# Altium project MB.PrjPcb (part 1 of 3)
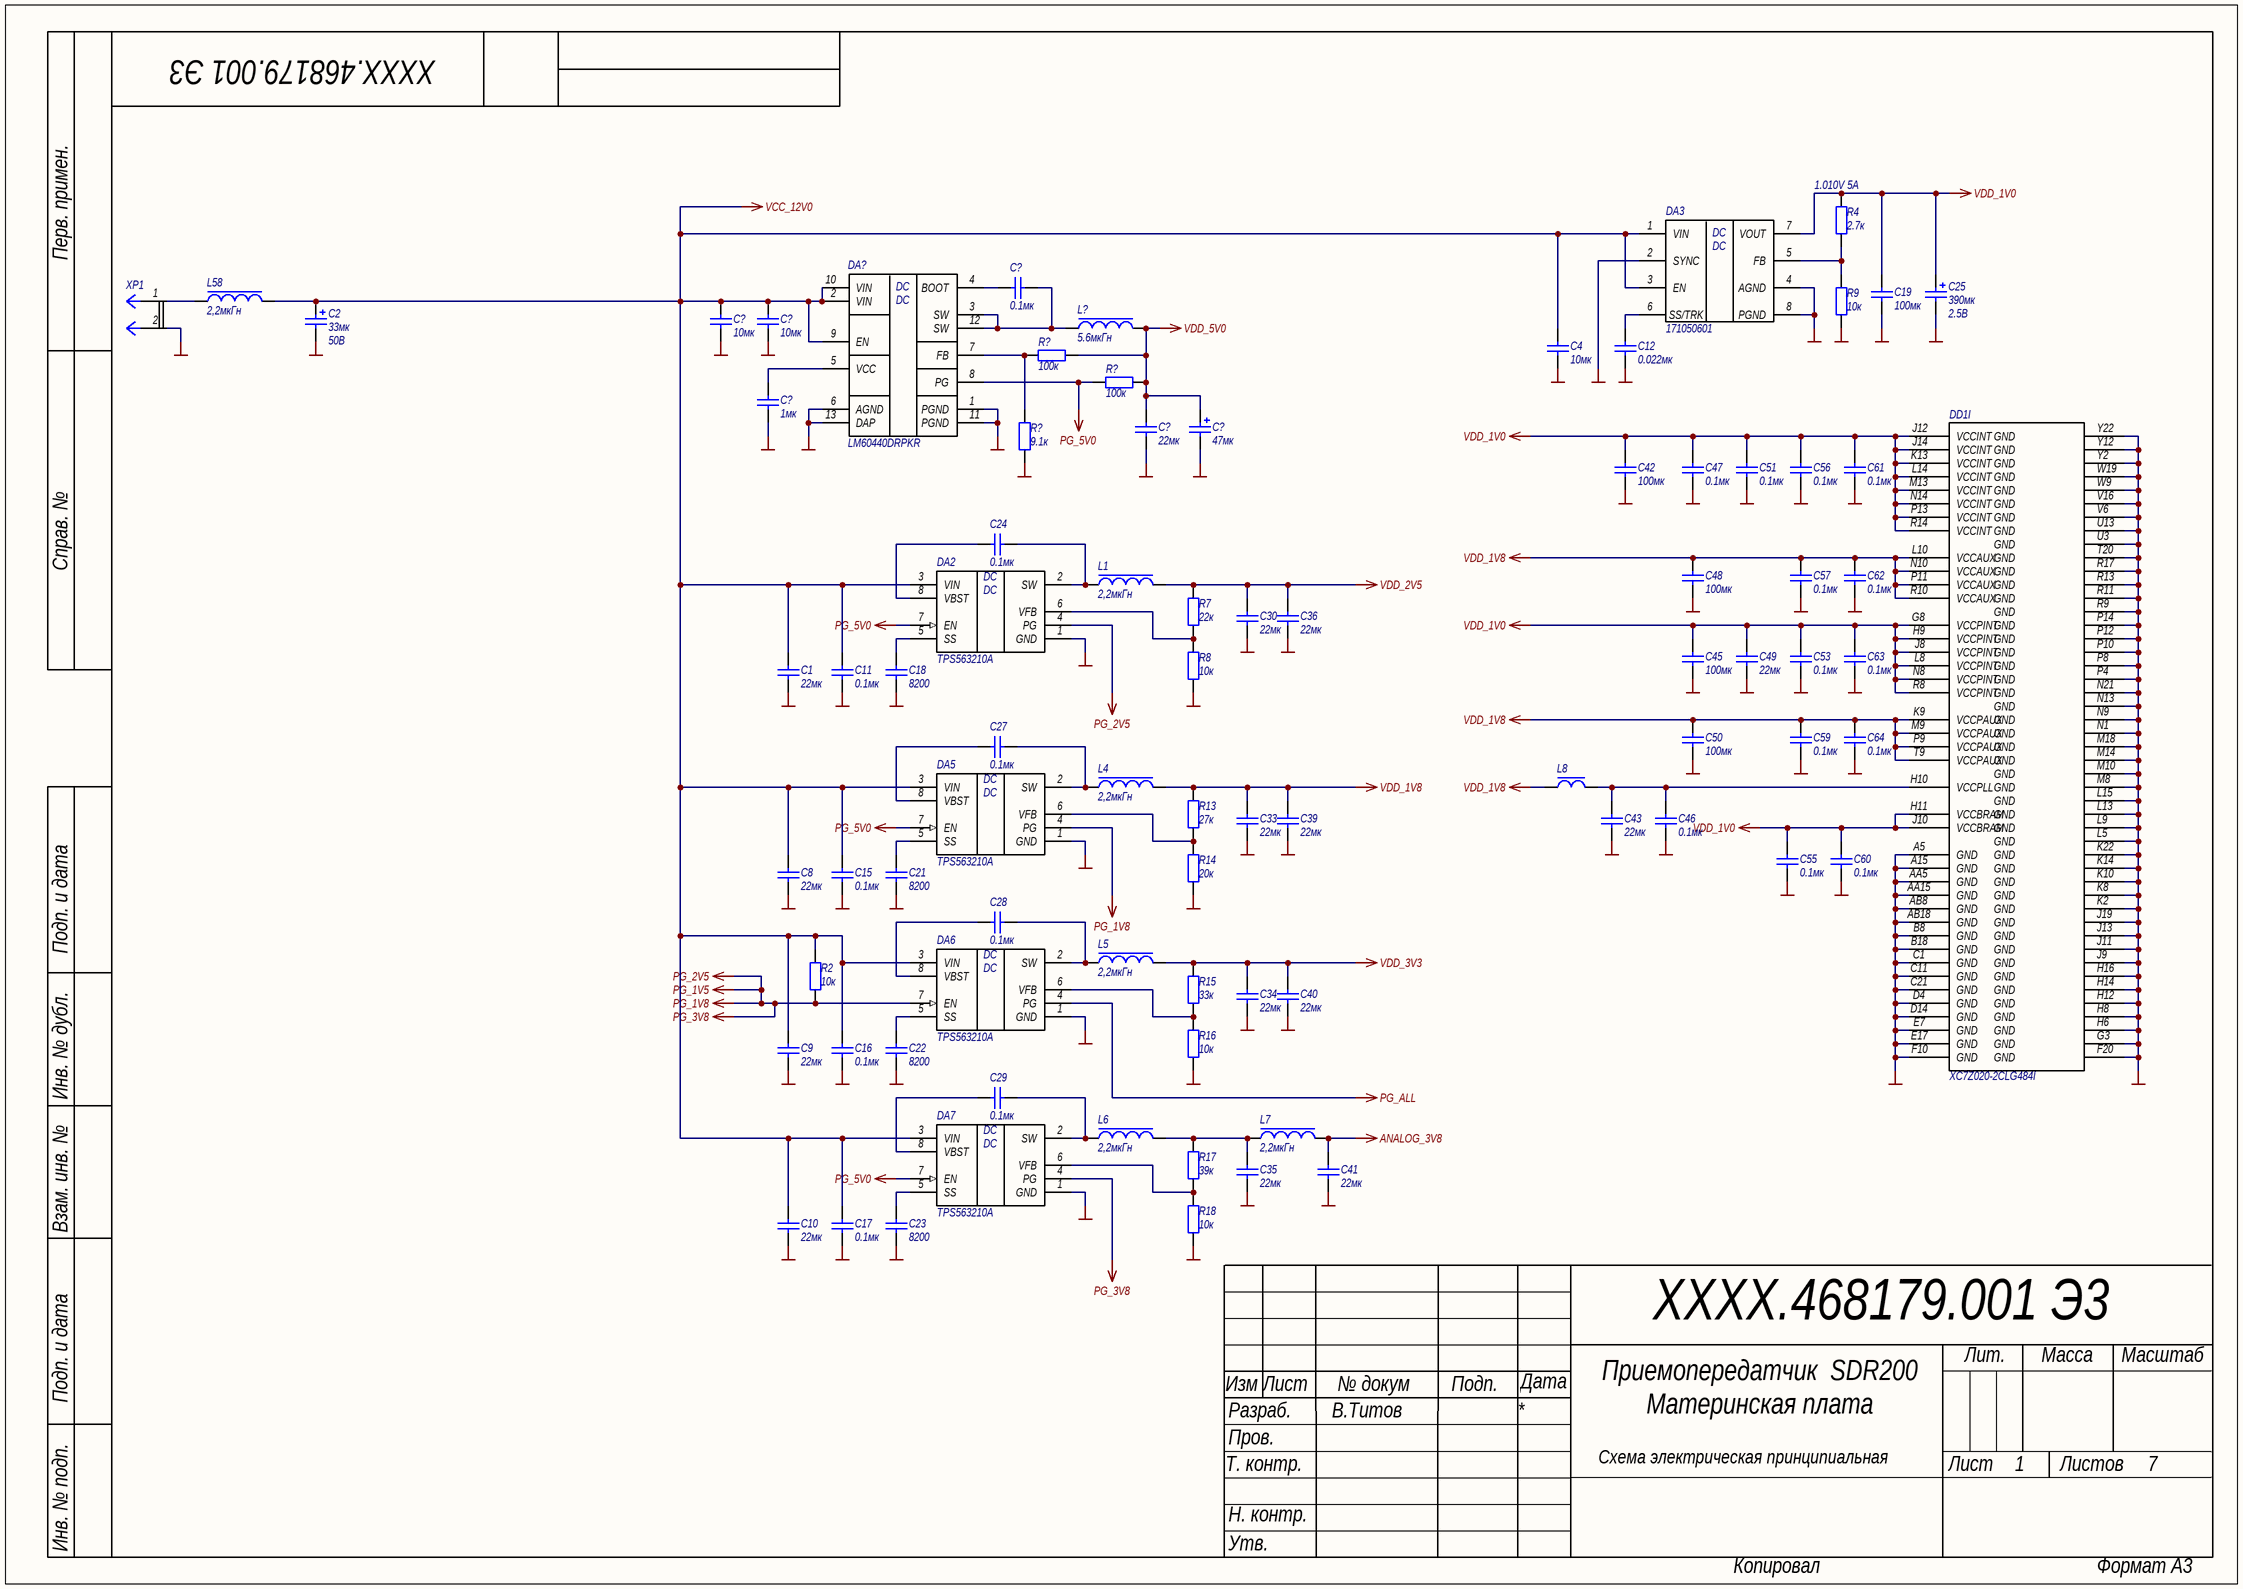
[diagram p0: MB_pwr_in_v2.SchDoc]
7 sheets, 655 parts. Net scope: global (net labels, ports and power ports of the same name join across sheets).
Board file: MB_v1.PcbDoc
Sheets:
  MB_pwr_in_v2.SchDoc
  MB_ps_io.SchDoc
  MB_ddr.SchDoc
  MB_pl_io.SchDoc
  MB_adc_clk.SchDoc
  MB_dac.SchDoc
  MB_audio.SchDoc

## Sheet MB_pwr_in_v2.SchDoc: Приемопередатчик  SDR200
size 420 x 297 mm; Author: В.Титов; DrawnBy: В.Титов; DocumentNumber: ХХХХ.468179.001 Э3; SheetNumber: 1; SheetTotal: 7; DocumentType: Схема электрическая принципиальная; Title2: Материнская плата; Scale: 1:1

### Parts
(Parts that share a designator on the sheet are numbered #1, #2 ... from top to bottom, then left to right.)
C1  22мк  [CAPC2012X12L]
C2  Power/Voltage: 50В  [CAPAE7664X77L]  (hidden comment: 33мк)
C4  10мк  [CAPC3225X27L]
C8  22мк  [CAPC2012X12L]
C9  22мк  [CAPC2012X12L]
C10  22мк  [CAPC2012X12L]
C11  0.1мк  [CAPC1005X06N]
C12  0.022мк  [CAPC1005X06N]
C15  0.1мк  [CAPC1005X06N]
C16  0.1мк  [CAPC1005X06N]
C17  0.1мк  [CAPC1005X06N]
C18  8200  [CAPC1005X06N]
C19  100мк  [CAPC3216X19L]
C21  8200  [CAPC1005X06N]
C22  8200  [CAPC1005X06N]
C23  8200  [CAPC1005X06N]
C24  0.1мк  [CAPC1005X06N]
C25  Power/Voltage: 2.5В  [CAPAE7266X61N]  (hidden comment: 390мк)
C27  0.1мк  [CAPC1005X06N]
C28  0.1мк  [CAPC1005X06N]
C29  0.1мк  [CAPC1005X06N]
C30  22мк  [CAPC2012X12L]
C33  22мк  [CAPC2012X12L]
C34  22мк  [CAPC2012X12L]
C35  22мк  [CAPC2012X12L]
C36  22мк  [CAPC2012X12L]
C39  22мк  [CAPC2012X12L]
C40  22мк  [CAPC2012X12L]
C41  22мк  [CAPC2012X12L]
C42  100мк  [CAPC3216X19L]
C43  22мк  [CAPC2012X12L]
C45  100мк  [CAPC3216X19L]
C46  0.1мк  [CAPC1005X06N]
C47  0.1мк  [CAPC1005X06N]
C48  100мк  [CAPC3216X19L]
C49  22мк  [CAPC2012X12L]
C50  100мк  [CAPC3216X19L]
C51  0.1мк  [CAPC1005X06N]
C53  0.1мк  [CAPC1005X06N]
C55  0.1мк  [CAPC1005X06N]
C56  0.1мк  [CAPC1005X06N]
C57  0.1мк  [CAPC1005X06N]
C59  0.1мк  [CAPC1005X06N]
C60  0.1мк  [CAPC1005X06N]
C61  0.1мк  [CAPC1005X06N]
C62  0.1мк  [CAPC1005X06N]
C63  0.1мк  [CAPC1005X06N]
C64  0.1мк  [CAPC1005X06N]
C?#1  0.1мк  [CAPC1005X06N]
C?#2  10мк  [CAPC3225X27L]
C?#3  10мк  [CAPC3225X27L]
C?#4  1мк  [CAPC1005X06N]
C?#5  22мк  [CAPC2012X12L]
C?#6  47мк  [CAPMP7343X28L]
DA2  TPS563210A  [TSOP65P280X110-8N]
DA3  171050601  [TO263-7EP]
DA5  TPS563210A  [TSOP65P280X110-8N]
DA6  TPS563210A  [TSOP65P280X110-8N]
DA7  TPS563210A  [TSOP65P280X110-8N]
DA?  LM60440DRPKR  [WQFN-13]
DD1  XC7Z020-2CLG484I  [BGA484C80P22X22_1900X1900X160]  (part I of 9)
L1  2,2мкГн  [CSAB0420]
L4  2,2мкГн  [CSAB0420]
L5  2,2мкГн  [CSAB0420]
L6  2,2мкГн  [CSAB0420]
L7  2,2мкГн  [CSAB0420]
L8  BLM18PG121SN1D  [INDC1608X08L]  (value not drawn)
L58  2,2мкГн  [CSAB0420]
L?  5.6мкГн  [Coilcraft-XAL5030]
R2  10к  [RESC1005X06N]
R4  2.7к  [RESC1005X06N]
R7  22к  [RESC1005X06N]
R8  10к  [RESC1005X06N]
R9  10к  [RESC1005X06N]
R13  27к  [RESC1005X06N]
R14  20к  [RESC1005X06N]
R15  33к  [RESC1005X06N]
R16  10к  [RESC1005X06N]
R17  39к  [RESC1005X06N]
R18  10к  [RESC1005X06N]
R?#1  100к  [RESC1005X06N]
R?#2  100к  [RESC1005X06N]
R?#3  9.1к  [RESC1005X06N]
XP1  XT30UPB-M  [XT30UPB-M]  (value not drawn)

### Nets
ANALOG_3V8: C41.2 L7.2
GND: C1.1 C2.2 C4.1 C8.1 C9.1 C10.1 C11.1 C12.1 C15.1 C16.1 C17.1 C18.1 C19.1 C21.1 C22.1 C23.1 C25.2 C30.1 C33.1 C34.1 C35.1 C36.1 C39.1 C40.1 C41.1 C42.1 C43.1 C45.1 C46.1 C47.1 C48.1 C49.1 C50.1 C51.1 C53.1 C55.1 C56.1 C57.1 C59.1 C60.1 C61.1 C62.1 C63.1 C64.1 C?#2.1 C?#3.1 C?#4.1 C?#5.1 C?#6.2 DA2.1(GND) DA3.2(SYNC) DA3.4(AGND) DA3.8(PGND) DA5.1(GND) DA6.1(GND) DA7.1(GND) DA?.1(PGND) DA?.6(AGND) DA?.11(PGND) DA?.13(DAP) DD1.A5(GND) DD1.A15(GND) DD1.AA5(GND) DD1.AA15(GND) DD1.AB8(GND) DD1.AB18(GND) DD1.B8(GND) DD1.B18(GND) DD1.C1(GND) DD1.C11(GND) DD1.C21(GND) DD1.D4(GND) DD1.D14(GND) DD1.E7(GND) DD1.E17(GND) DD1.F10(GND) DD1.F20(GND) DD1.G3(GND) DD1.H6(GND) DD1.H8(GND) DD1.H12(GND) DD1.H14(GND) DD1.H16(GND) DD1.J9(GND) DD1.J11(GND) DD1.J13(GND) DD1.J19(GND) DD1.K2(GND) DD1.K8(GND) DD1.K10(GND) DD1.K14(GND) DD1.K22(GND) DD1.L5(GND) DD1.L9(GND) DD1.L13(GND) DD1.L15(GND) DD1.M8(GND) DD1.M10(GND) DD1.M14(GND) DD1.M18(GND) DD1.N1(GND) DD1.N9(GND) DD1.N13(GND) DD1.N21(GND) DD1.P4(GND) DD1.P8(GND) DD1.P10(GND) DD1.P12(GND) DD1.P14(GND) DD1.R9(GND) DD1.R11(GND) DD1.R13(GND) DD1.R17(GND) DD1.T20(GND) DD1.U3(GND) DD1.U13(GND) DD1.V6(GND) DD1.V16(GND) DD1.W9(GND) DD1.W19(GND) DD1.Y2(GND) DD1.Y12(GND) DD1.Y22(GND) R8.2 R9.2 R14.2 R16.2 R18.2 R?#3.2 XP1.2
PG_1V5: DA2.4(PG) DA5.4(PG) DA6.7(EN) DA7.4(PG) R2.1  [also labelled PG_1V8, PG_2V5, PG_3V8]
PG_5V0: DA2.7(EN) DA5.7(EN) DA7.7(EN) DA?.8(PG) R?#2.2
PG_ALL: DA6.4(PG)
VCC_12V0: C1.2 C2.1 C4.2 C8.2 C9.2 C10.2 C11.2 C15.2 C16.2 C17.2 C?#2.2 C?#3.2 DA2.3(VIN) DA3.1(VIN) DA3.3(EN) DA5.3(VIN) DA6.3(VIN) DA7.3(VIN) DA?.2(VIN) DA?.9(EN) DA?.10(VIN) L58.2 R2.2
VDD_1V0: C19.2 C25.1 C42.2 C45.2 C47.2 C49.2 C51.2 C53.2 C55.2 C56.2 C60.2 C61.2 C63.2 DA3.7(VOUT) DD1.G8(VCCPINT) DD1.H9(VCCPINT) DD1.H11(VCCBRAM) DD1.J8(VCCPINT) DD1.J10(VCCBRAM) DD1.J12(VCCINT) DD1.J14(VCCINT) DD1.K13(VCCINT) DD1.L8(VCCPINT) DD1.L14(VCCINT) DD1.M13(VCCINT) DD1.N8(VCCPINT) DD1.N14(VCCINT) DD1.P13(VCCINT) DD1.R8(VCCPINT) DD1.R14(VCCINT) R4.2
VDD_1V8: C33.2 C39.2 C48.2 C50.2 C57.2 C59.2 C62.2 C64.2 DD1.K9(VCCPAUX) DD1.L10(VCCAUX) DD1.M9(VCCPAUX) DD1.N10(VCCAUX) DD1.P9(VCCPAUX) DD1.P11(VCCAUX) DD1.R10(VCCAUX) DD1.T9(VCCPAUX) L4.2 L8.1 R13.2
VDD_2V5: C30.2 C36.2 L1.2 R7.2
VDD_3V3: C34.2 C40.2 L5.2 R15.2
VDD_5V0: C?#5.2 C?#6.1 L?.2 R?#1.1 R?#2.1
NetC12_2: C12.2 DA3.6(SS/TRK)
NetC18_2: C18.2 DA2.5(SS)
NetC21_2: C21.2 DA5.5(SS)
NetC22_2: C22.2 DA6.5(SS)
NetC23_2: C23.2 DA7.5(SS)
NetC24_1: C24.1 DA2.2(SW) L1.1
NetC24_2: C24.2 DA2.8(VBST)
NetC27_1: C27.1 DA5.2(SW) L4.1
NetC27_2: C27.2 DA5.8(VBST)
NetC28_1: C28.1 DA6.2(SW) L5.1
NetC28_2: C28.2 DA6.8(VBST)
NetC29_1: C29.1 DA7.2(SW) L6.1
NetC29_2: C29.2 DA7.8(VBST)
NetC35_2: C35.2 L6.2 L7.1 R17.2
NetC43_2: C43.2 C46.2 DD1.H10(VCCPLL) L8.2
NetC?#1_1: C?#1.1 DA?.3(SW) DA?.12(SW) L?.1
NetC?#1_2: C?#1.2 DA?.4(BOOT)
NetC?#4_2: C?#4.2 DA?.5(VCC)
NetDA2_6: DA2.6(VFB) R7.1 R8.1
NetDA3_5: DA3.5(FB) R4.1 R9.1
NetDA5_6: DA5.6(VFB) R13.1 R14.1
NetDA6_6: DA6.6(VFB) R15.1 R16.1
NetDA7_6: DA7.6(VFB) R17.1 R18.1
NetDA?_7: DA?.7(FB) R?#1.2 R?#3.1
NetL58_1: L58.1 XP1.1

### Notes on the sheet
- (near R4) 1.010V 5A
- Перв. примен.
- Справ. №
- Подп. и дата
- Инв. № дубл.
- Взам. инв. №
- Изм
- Лист
- № докум
- Подп.
- Дата
- Лит.
- Масса
- Масштаб
- Т. контр.
- Разраб.
- Пров.
- Листов
- Н. контр.
- Инв. № подп.
- Утв.
- Копировал
- Формат А3
- (in symbol Микросхема LM60440DRPKR) DC
- (in symbol Микросхема TPS563210A) DC
- (in symbol Микросхема WPMDM1500602JT / 171050601) DC

### Library data of the parts
C1 C8-C10 C30 C33-C36 C39-C41 C43 C49 C?#5 = Кер.ЧИП конд. 0805 22мкФ X5R 10% 16В: Кер. ЧИП-конденсатор; Manufacturer: TDK; ManufacturerPartNumber: C2012X5R1C226KT; Power/Voltage: 16В; TKE: X5R; Tolerance: ±10%; Value: 22мк
C2 = Конденсатор гибридный SMD 33мкФ ±20% 50В: Гибридный ЧИП-конденсатор; ManufacturerPartNumber: EEHZC1H330XP; Manufacturer: Panasonic; Tolerance: ±20%; Published: 8-Jun-2000; LatestRevisionDate: 29-May-2009; LatestRevisionNote: IPC-7351 Footprint Added.; Publisher: Altium Limited; PackageDescription: ZC Series - Anti-Vibration; PackageReference: ZC Series; Value: 33мк
C4 C?#2 C?#3 = Кер.ЧИП конд. 1210 10мкФ X5R 20% 50В: Кер. ЧИП-конденсатор; Manufacturer: Murata; ManufacturerPartNumber: GRM32ER71H106; Power/Voltage: 50В; TKE: X5R; Tolerance: ±20%; Value: 10мк
C11 C15-C17 C24 C27-C29 C46 C47 C51 C53 C55-C57 C59-C64 C?#1 = Кер.ЧИП конд. 0402 0.1мкФ X7R 10%, 16В: Кер. ЧИП-конденсатор; Power/Voltage: 16В; TKE: X7R; Tolerance: ±10%; PackageReference: 0402; Value: 0.1мк
C12 = Кер.ЧИП конд. 0402 0.022мкФ X7R 10%, 50В: Кер. ЧИП-конденсатор; Power/Voltage: 50В; TKE: X7R; Tolerance: ±20%; Value: 0.022мк
C18 C21-C23 = Кер.ЧИП конд. 0402 8200пФ X7R 10%, 50В: Кер. ЧИП-конденсатор; Power/Voltage: 50В; TKE: X7R; Tolerance: ±20%; Value: 8200
C19 C42 C45 C48 C50 = Кер.ЧИП конд. 1206 100мкФ X5R 20% 6.3В: Кер. ЧИП-конденсатор; Manufacturer: Murata; ManufacturerPartNumber: GRM31CR60J107ME39L; Power/Voltage: 6.3В; TKE: X5R; Tolerance: ±20%; Value: 100мк
C25 = Конденсатор гибридный SMD 390мкФ ±20% 2.5В: Aluminum Organic Polymer Capacitor; Manufacturer: Panasonic; ManufacturerPartNumber: EEHZC1H330XP; Tolerance: ±20%; Value: 390мк; Published: 8-Jun-2000; LatestRevisionDate: 29-May-2009; LatestRevisionNote: IPC-7351 Footprint Added.; Publisher: Altium Limited; PackageDescription: ZC Series - Anti-Vibration; PackageReference: ZC Series
C?#4 = Кер.ЧИП конд. 0402 1мкФ X5R 10%, 10В: Кер. ЧИП-конденсатор; Power/Voltage: 10В; TKE: X5R; Tolerance: ±10%; PackageReference: 0402; Value: 1мк
C?#6 = Конденсатор танталовый SMD D case 47мкФ ±10% 25B: Тант. ЧИП-конденсатор; Power/Voltage: 25В; Tolerance: ±10%; Value: 47мк; Published: 8-Jun-2000; LatestRevisionDate: 29-May-2009; LatestRevisionNote: IPC-7351 Footprint Added.; Publisher: Altium Limited; PackageDescription: Chip Capacitor; PackageReference: тип D
DA2 DA5-DA7 = Микросхема TPS563210A: TPS56x210A, 4.5-V to 17-V Input, 2-A, 3-A Synchrono; Manufacturer: TI; Value: TPS563210A
DA3 = Микросхема WPMDM1500602JT / 171050601: MagI3C Power Module VDRM – Variable Step Down Regulator Module; Manufacturer: Würth Elektronik; Value: 171050601; ComponentLink1Description: datasheet; ComponentLink1URL: https://katalog.we-online.de/pm/datasheet/171050601.pdf
DA? = Микросхема LM60440DRPKR: 3.8-V to 36-V, 4-A Ultra-Small Synchronous Step-Down Converter; Value: LM60440DRPKR; ComponentLink1Description: datasheet; ComponentLink1URL: https://www.ti.com/lit/ds/symlink/lm60440.pdf?HQS=dis-dk-null-digikeymode-dsf-pf-null-wwe&ts=1663282176250&ref_url=https%253A%252F%252Fwww.digikey.si%252F
DD1 = Микросхема XC7Z020-2CLG484I: Zynq®-7000 SoC Family; Manufacturer: XILINX; Value: XC7Z020-2CLG484I; ComponentLink1Description: datasheet; ComponentLink1URL: https://www.xilinx.com/support/documentation/data_sheets/ds925-zynq-ultrascale-plus.pdf
L1 L4-L7 L58 = ЧИП индуктивность CSAB0420-2R2M: Molding Power Choke; Manufacturer: Vishay; ManufacturerPartNumber: IHLP1616ABER1R0M11; Value: 2,2мкГн
L8 = ЧИП дроссель 0603 BLM18PG121SN1D: SMD EMI Suppression Filter EMIFIL; Manufacturer: Murata; ManufacturerPartNumber: BLM18PG121SN1D; Value: BLM18PG121SN1D
L? = ЧИП индуктивность XAL5030-562MEB: Shielded Power Inductor – XAL5030; Manufacturer: Сoilcraft; ManufacturerPartNumber: XAL5030-222MEB; Value: 5.6мкГн
R2 = Чип резистор 0402 10 кОм, 1%: ЧИП-резистор; Tolerance: ±5%; TKE: 100 ppm/°С; PackageReference: 0402; Value: 10к
R4 = Чип резистор 0402 2,7 кОм, 5%: ЧИП-резистор; Tolerance: ±5%; TKE: 100 ppm/°С; PackageReference: 0402; Value: 2.7к
R7 = Чип резистор 0402 22 кОм, 5%: ЧИП-резистор; Tolerance: ±5%; TKE: 100 ppm/°С; PackageReference: 0402; Value: 22к
R8 R9 R16 R18 = Чип резистор 0402 10 кОм, 5%: ЧИП-резистор; Tolerance: ±5%; TKE: 100 ppm/°С; PackageReference: 0402; Value: 10к
R13 = Чип резистор 0402 27 кОм, 5%: ЧИП-резистор; Tolerance: ±5%; TKE: 100 ppm/°С; PackageReference: 0402; Value: 27к
R14 = Чип резистор 0402 20 кОм, 5%: ЧИП-резистор; Tolerance: ±5%; TKE: 100 ppm/°С; PackageReference: 0402; Value: 20к
R15 = Чип резистор 0402 33 кОм, 5%: ЧИП-резистор; Tolerance: ±5%; TKE: 100 ppm/°С; PackageReference: 0402; Value: 33к
R17 = Чип резистор 0402 39 кОм, 5%: ЧИП-резистор; Tolerance: ±5%; TKE: 100 ppm/°С; PackageReference: 0402; Value: 39к
R?#1 R?#2 = Чип резистор 0402 100 кОм, 5%: ЧИП-резистор; Tolerance: ±5%; TKE: 100 ppm/°С; PackageReference: 0402; Value: 100к
R?#3 = Чип резистор 0402 9,1 кОм, 5%: ЧИП-резистор; Tolerance: ±5%; TKE: 100 ppm/°С; PackageReference: 0402; Value: 9.1к
XP1 = Соединитель XT30UPB-M: AMASS XT30UPB-M  5 mm; Value: XT30UPB-M

## Sheet MB_ps_io.SchDoc: Материнская плата
size 420 x 297 mm; DrawnBy: В.Титов; DocumentNumber: ХХХХ.468179.001 Э3; SheetNumber: 2; SheetTotal: 7; DocumentType: Схема электрическая принципиальная; Title2: Питание процессора
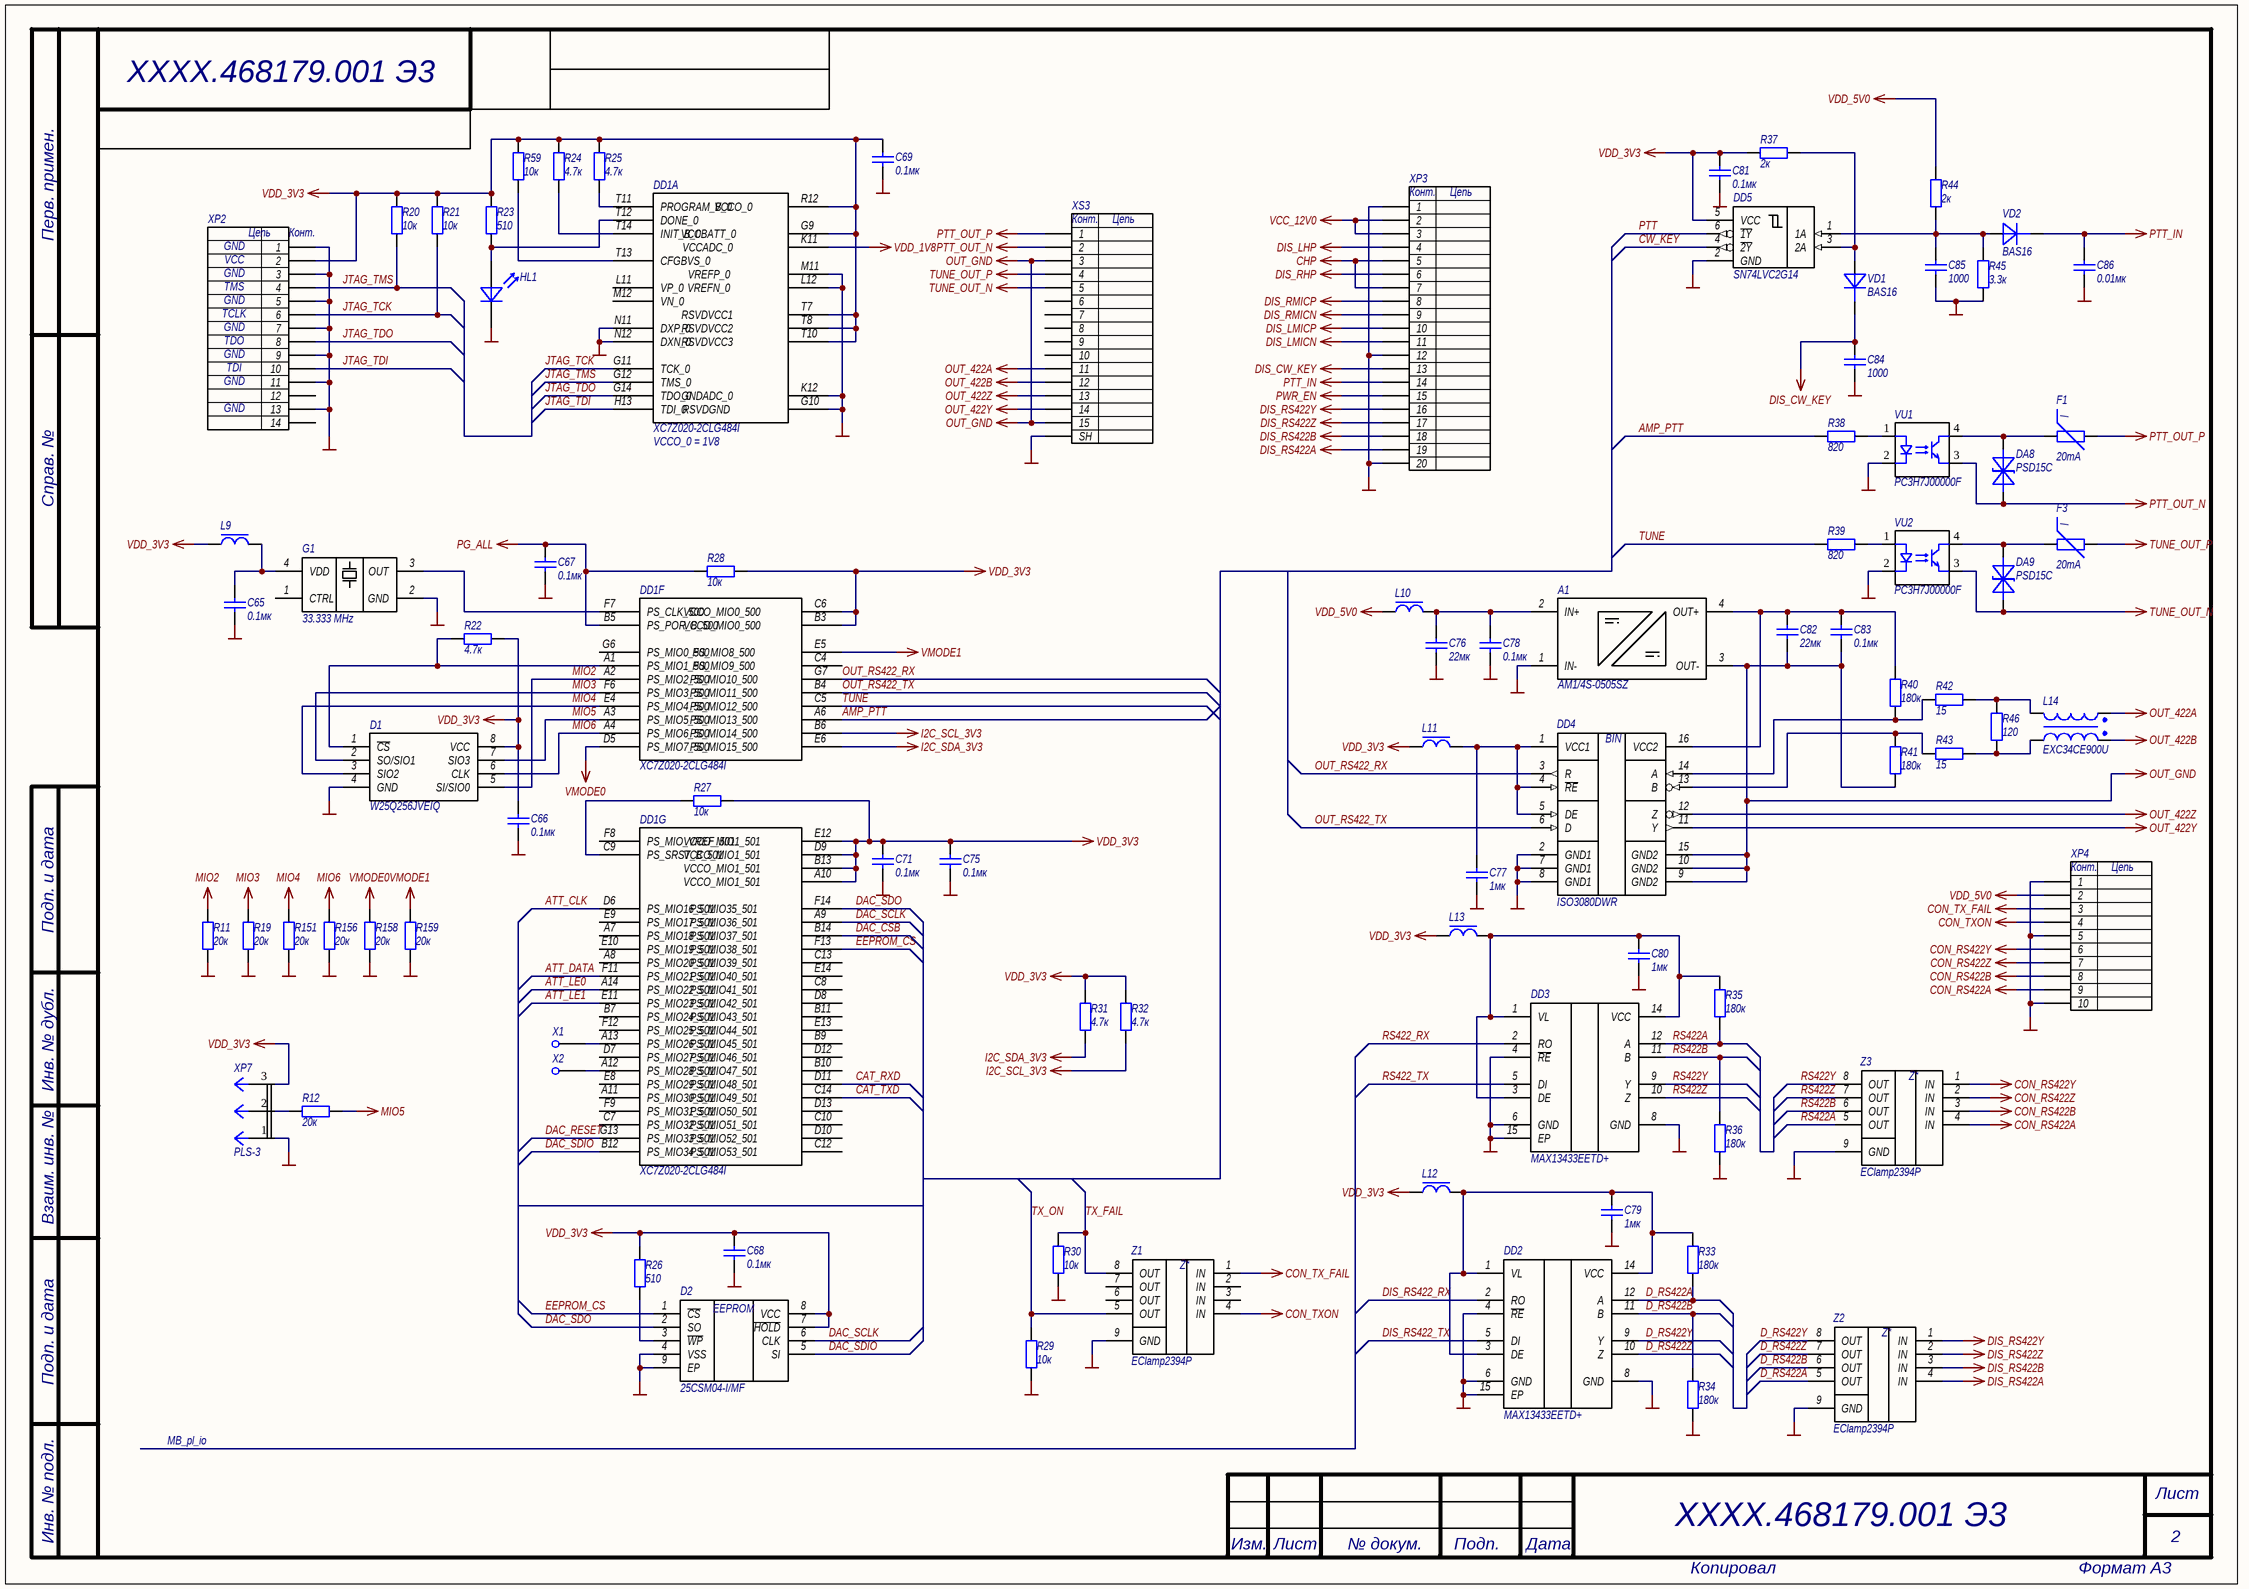
[diagram p1: MB_ps_io.SchDoc]

### Parts
A1  AM1/4S-0505SZ  [Series AM1/4S-Z]
C65  0.1мк  [CAPC1005X06N]
C66  0.1мк  [CAPC1005X06N]
C67  0.1мк  [CAPC1005X06N]
C68  0.1мк  [CAPC1005X06N]
C69  0.1мк  [CAPC1005X06N]
C71  0.1мк  [CAPC1005X06N]
C75  0.1мк  [CAPC1005X06N]
C76  22мк  [CAPC2012X12L]
C77  1мк  [CAPC1005X06N]
C78  0.1мк  [CAPC1005X06N]
C79  1мк  [CAPC1005X06N]
C80  1мк  [CAPC1005X06N]
C81  0.1мк  [CAPC1005X06N]
C82  22мк  [CAPC2012X12L]
C83  0.1мк  [CAPC1005X06N]
C84  1000  [CAPC1005X06N]
C85  1000  [CAPC1005X06N]
C86  0.01мк  [CAPC1005X06N]
D1  W25Q256JVEIQ  [SON127P800X70_HS-9N]
D2  25CSM04-I/MF  [SON127P600X80_HS-9N]
DA8  PSD15C  [SOT0P254X110-2N]
DA9  PSD15C  [SOT0P254X110-2N]
DD1  XC7Z020-2CLG484I  [BGA484C80P22X22_1900X1900X160]  (parts A,F,G of 9)
DD2  MAX13433EETD+  [SON40P300X80_HS-15L]
DD3  MAX13433EETD+  [SON40P300X80_HS-15L]
DD4  ISO3080DWR  [SOIC127P1030X265-16N]
DD5  SN74LVC2G14  [SOT65P210X110-6L]
F1  20mA  [FUSC1607X85N]
F3  20mA  [FUSC1607X85N]
G1  33.333 MHz  [XTAL_ASFLMB-33.333MHZ-LC-T]
HL1  (no value)  [CD1608-0603_GREEN]
L9  BLM18PG121SN1D  [INDC1608X08L]  (value not drawn)
L10  BLM18PG121SN1D  [INDC1608X08L]  (value not drawn)
L11  BLM18PG121SN1D  [INDC1608X08L]  (value not drawn)
L12  BLM18PG121SN1D  [INDC1608X08L]  (value not drawn)
L13  BLM18PG121SN1D  [INDC1608X08L]  (value not drawn)
L14  EXC34CE900U  [EXC34CE900U]
R11  20к  [RESC1005X06N]
R12  20к  [RESC1005X06N]
R19  20к  [RESC1005X06N]
R20  10к  [RESC1005X06N]
R21  10к  [RESC1005X06N]
R22  4.7к  [RESC1005X06N]
R23  510  [RESC1005X06N]
R24  4.7к  [RESC1005X06N]
R25  4.7к  [RESC1005X06N]
R26  510  [RESC1005X06N]
R27  10к  [RESC1005X06N]
R28  10к  [RESC1005X06N]
R29  10к  [RESC1005X06N]
R30  10к  [RESC1005X06N]
R31  4.7к  [RESC1005X06N]
R32  4.7к  [RESC1005X06N]
R33  180к  [RESC1005X06N]
R34  180к  [RESC1005X06N]
R35  180к  [RESC1005X06N]
R36  180к  [RESC1005X06N]
R37  2к  [RESC1005X06N]
R38  820  [RESC1005X06N]
R39  820  [RESC1005X06N]
R40  180к  [RESC1005X06N]
R41  180к  [RESC1005X06N]
R42  15  [RESC1005X06N]
R43  15  [RESC1005X06N]
R44  2к  [RESC1005X06N]
R45  3.3к  [RESC1005X06N]
R46  120  [RESC1005X06N]
R59  10к  [RESC1005X06N]
R151  20к  [RESC1005X06N]
R156  20к  [RESC1005X06N]
R158  20к  [RESC1005X06N]
R159  20к  [RESC1005X06N]
VD1  BAS16  [SOT23_N]
VD2  BAS16  [SOT23_N]
VU1  PC3H7J00000F  [SO4-170-1.27]
VU2  PC3H7J00000F  [SO4-170-1.27]
X1  Конструктивный элемент  [PIN2_PROBE]  (value not drawn)  (no BOM)
X2  Конструктивный элемент  [PIN2_PROBE]  (value not drawn)  (no BOM)
XP2  IDC2-14MS  [IDC2-14MS]  (value not drawn)
XP3  FH12-20S-0.5SVA  [FH12-20S-0.5SVA]  (value not drawn)
XP4  FH12-10S-0.5SVA  [FH12-10S-0.5SH]  (value not drawn)
XP7  PLS-3  [PLS-3 (DS1021-1x3)]
XS3  DS1038-15F  [DS1038-15F]  (value not drawn)
Z1  EClamp2394P  [SON50P160X65_HS-9N]
Z2  EClamp2394P  [SON50P160X65_HS-9N]
Z3  EClamp2394P  [SON50P160X65_HS-9N]

### Nets
ATT_CLK: DD1.D6(PS_MIO16_501)
ATT_DATA: DD1.F11(PS_MIO21_501)
ATT_LE0: DD1.A14(PS_MIO22_501)
ATT_LE1: DD1.E11(PS_MIO23_501)
CHP: XP3.5 XP3.7
CON_RS422A: XP4.9 Z3.4(IN)
CON_RS422B: XP4.8 Z3.3(IN)
CON_RS422Y: XP4.6 Z3.1(IN)
CON_RS422Z: XP4.7 Z3.2(IN)
CON_TX_FAIL: XP4.3 Z1.1(IN)
CON_TXON: XP4.4 Z1.4(IN)
DIS_CW_KEY: C84.2 VD1.3(K) XP3.13
DIS_LHP: XP3.4
DIS_LMICN: XP3.11
DIS_LMICP: XP3.10
DIS_RHP: XP3.6
DIS_RMICN: XP3.9
DIS_RMICP: XP3.8
DIS_RS422A: XP3.19 Z2.4(IN)
DIS_RS422B: XP3.18 Z2.3(IN)
DIS_RS422Y: XP3.16 Z2.1(IN)
DIS_RS422Z: XP3.17 Z2.2(IN)
GND: A1.1(IN-) C65.1 C66.1 C67.1 C68.1 C69.1 C71.1 C75.1 C76.1 C77.1 C78.1 C79.1 C80.1 C81.1 C84.1 C85.1 C86.1 D1.4(GND) D2.4(VSS) D2.9(EP) DD1.G10(RSVDGND) DD1.K12(GNDADC_0) DD1.L12(VREFN_0) DD1.M11(VREFP_0) DD1.N11(DXP_0) DD1.N12(DXN_0) DD2.4(~{RE}) DD2.6(GND) DD2.8(GND) DD2.15(EP) DD3.4(~{RE}) DD3.6(GND) DD3.8(GND) DD3.15(EP) DD4.2(GND1) DD4.7(GND1) DD4.8(GND1) DD5.2(GND) G1.2(GND) HL1.2(K) R11.1 R19.1 R29.1 R30.1 R34.1 R36.1 R45.2 R151.1 R156.1 R158.1 R159.1 VU1.2(K) VU2.2(K) XP2.1 XP2.3 XP2.5 XP2.7 XP2.9 XP2.11 XP2.13 XP3.1 XP3.12 XP3.20 XP4.1 XP4.5 XP4.10 XP7.1 XS3.16(SH) Z1.9(GND) Z2.9(GND) Z3.9(GND)
I2C_SCL_3V3: DD1.B6(PS_MIO14_500) R32.2
I2C_SDA_3V3: DD1.E6(PS_MIO15_500) R31.2
MIO2: D1.5(SI/SIO0) DD1.A2(PS_MIO2_500) R11.2
MIO3: D1.2(SO/SIO1) DD1.F6(PS_MIO3_500) R19.2
MIO4: D1.3(SIO2) DD1.E4(PS_MIO4_500) R151.2
MIO5: D1.7(SIO3) DD1.A3(PS_MIO5_500) R12.2
MIO6: D1.6(CLK) DD1.A4(PS_MIO6_500) R156.2
OUT_422A: L14.1 XS3.11
OUT_422B: L14.4 XS3.12
OUT_422Y: DD4.11(Y) XS3.14
OUT_422Z: DD4.12(Z) XS3.13
OUT_GND: A1.3(OUT-) C82.1 C83.1 DD4.9(GND2) DD4.10(GND2) DD4.15(GND2) R41.1 XS3.3 XS3.15
PG_ALL: C67.2 DD1.B5(PS_POR_B_500) R28.1
PTT_IN: C86.2 VD2.3(K) XP3.14
PTT_OUT_N: DA8.2 VU1.3(E) XS3.2
PTT_OUT_P: F1.1 XS3.1
PWR_EN: XP3.15
TUNE_OUT_N: DA9.2 VU2.3(E) XS3.5
TUNE_OUT_P: F3.1 XS3.4
VCC_12V0: XP3.2 XP3.3
VDD_1V8: DD1.K11(VCCADC_0)
VDD_3V3: C66.2 C68.2 C69.2 C71.2 C75.2 C81.2 D1.8(VCC) D2.7(~{HOLD}) D2.8(VCC) DD1.A10(VCCO_MIO1_501) DD1.B3(VCCO_MIO0_500) DD1.B13(VCCO_MIO1_501) DD1.C6(VCCO_MIO0_500) DD1.D9(VCCO_MIO1_501) DD1.E12(VCCO_MIO1_501) DD1.G9(VCCBATT_0) DD1.R12(VCCO_0) DD1.T7(RSVDVCC1) DD1.T8(RSVDVCC2) DD1.T10(RSVDVCC3) DD5.5(VCC) L9.1 L11.1 L12.1 L13.1 R20.1 R21.1 R22.2 R23.1 R24.1 R25.1 R26.1 R27.2 R28.2 R31.1 R32.1 R37.2 R59.2 XP2.2 XP7.3
VDD_5V0: L10.1 R44.2 XP4.2
VMODE0: DD1.D5(PS_MIO7_500) R158.2
VMODE1: DD1.E5(PS_MIO8_500) R159.2
AMP_PTT: DD1.A6(PS_MIO13_500) R38.1
CAT_RXD: DD1.D11(PS_MIO48_501)
CAT_TXD: DD1.C14(PS_MIO49_501)
CW_KEY: DD5.4(~{2Y})
D_RS422A: DD2.12(A) R33.1 Z2.5(OUT)
D_RS422B: DD2.11(B) R34.2 Z2.6(OUT)
D_RS422Y: DD2.9(Y) Z2.8(OUT)
D_RS422Z: DD2.10(Z) Z2.7(OUT)
DAC_CSB: DD1.B14(PS_MIO37_501)
DAC_RESET: DD1.G13(PS_MIO33_501)
DAC_SCLK: D2.6(CLK) DD1.A9(PS_MIO36_501)
DAC_SDIO: D2.5(SI) DD1.B12(PS_MIO34_501)
DAC_SDO: D2.2(SO) DD1.F14(PS_MIO35_501)
DIS_RS422_RX: DD2.2(RO)
DIS_RS422_TX: DD2.5(DI)
EEPROM_CS: D2.1(~{CS}) DD1.F13(PS_MIO38_501)
JTAG_TCK: DD1.G11(TCK_0) R21.2 XP2.6
JTAG_TDI: DD1.H13(TDI_0) XP2.10
JTAG_TDO: DD1.G14(TDO_0) XP2.8
JTAG_TMS: DD1.G12(TMS_0) R20.2 XP2.4
OUT_RS422_RX: DD1.G7(PS_MIO10_500) DD4.3(R)
OUT_RS422_TX: DD1.B4(PS_MIO11_500) DD4.6(D)
PTT: DD5.6(~{1Y})
RS422_RX: DD3.2(RO)
RS422_TX: DD3.5(DI)
RS422A: DD3.12(A) R35.1 Z3.5(OUT)
RS422B: DD3.11(B) R36.2 Z3.6(OUT)
RS422Y: DD3.9(Y) Z3.8(OUT)
RS422Z: DD3.10(Z) Z3.7(OUT)
TUNE: DD1.C5(PS_MIO12_500) R39.1
TX_FAIL: R30.2 Z1.8(OUT)
TX_ON: R29.2 Z1.5(OUT)
NetA1_2: A1.2(IN+) C76.2 C78.2 L10.2
NetA1_4: A1.4(OUT+) C82.2 C83.2 DD4.16(VCC2) R40.2
NetC65_2: C65.2 G1.4(VDD) L9.2
NetC77_2: C77.2 DD4.1(VCC1) DD4.4(~{RE}) DD4.5(DE) L11.2
NetC79_2: C79.2 DD2.1(VL) DD2.3(DE) DD2.14(VCC) L12.2 R33.2
NetC80_2: C80.2 DD3.1(VL) DD3.3(DE) DD3.14(VCC) L13.2 R35.2
NetC85_2: C85.2 DD5.1(1A) R44.1 R45.1 VD2.1(A)
NetD1_1: D1.1(~{CS}) DD1.A1(PS_MIO1_500) R22.1
NetD2_3: D2.3(~{WP}) R26.2
NetDA8_1: DA8.1 F1.2 VU1.4(C)
NetDA9_1: DA9.1 F3.2 VU2.4(C)
NetDD1_A12   : DD1.A12(PS_MIO28_501) X2.1
NetDD1_A13   : DD1.A13(PS_MIO26_501) X1.1
NetDD1_C9    : DD1.C9(PS_SRST_B_501) R27.1
NetDD1_F7    : DD1.F7(PS_CLK_500) G1.3(OUT)
NetDD1_T11   : DD1.T11(PROGRAM_B_0) R25.2
NetDD1_T12   : DD1.T12(DONE_0) HL1.1(A) R23.2
NetDD1_T13   : DD1.T13(CFGBVS_0) R59.1
NetDD1_T14   : DD1.T14(INIT_B_0) R24.2
NetDD4_13: DD4.13(B) R41.2 R43.1
NetDD4_14: DD4.14(A) R40.1 R42.1
NetDD5_3: DD5.3(2A) R37.1 VD1.1(A)
NetL14_2: L14.2 R42.2 R46.1
NetL14_3: L14.3 R43.2 R46.2
NetR12_1: R12.1 XP7.2
NetR38_2: R38.2 VU1.1(A)
NetR39_2: R39.2 VU2.1(A)

Not connected (* = marked no-connect by the designer): DD1 A7    (PS_MIO18_501_____________) A8    (PS_MIO20_501_____________) A11   (PS_MIO30_501_____________) B7    (PS_MIO24_501_____________) B9    (PS_MIO45_501_____________) B10   (PS_MIO47_501_____________) B11   (PS_MIO43_501_____________) C4    (PS_MIO9_500______________) C7    (PS_MIO32_501_____________) C8    (PS_MIO41_501_____________) C10   (PS_MIO51_501_____________) C12   (PS_MIO53_501_____________) C13   (PS_MIO39_501_____________) D7    (PS_MIO27_501_____________) D8    (PS_MIO42_501_____________) D10   (PS_MIO52_501_____________) D12   (PS_MIO46_501_____________) D13   (PS_MIO50_501_____________) E8    (PS_MIO29_501_____________) E9    (PS_MIO17_501_____________) E10   (PS_MIO19_501_____________) E13   (PS_MIO44_501_____________) E14   (PS_MIO40_501_____________) F8    (PS_MIO_VREF_501__________) F9    (PS_MIO31_501_____________) F12   (PS_MIO25_501_____________) G6    (PS_MIO0_500______________) L11   (VP_0_____________________) M12   (VN_0_____________________); G1 1(CTRL); XP2 12 14; XS3 6 7 8 9 10; Z1 2(IN) 3(IN) 6(OUT) 7(OUT)

### Notes on the sheet
- (near DD1) VCCO_0 = 1V8
- MB_pl_io
- Перв. примен.
- Справ. №
- Подп. и дата
- Инв. № дубл.
- Взаим. инв. №
- Инв. № подл.
- Лист
- Изм.
- № докум.
- Подп.
- Дата
- Копировал
- Формат А3
- (in symbol Микросхема 25CSM04-I/MF) EEPROM
- (in symbol Микросхема ISO3080DWR) BIN
- (in symbol Соединитель DHR-15FB (DS1038-15F)) Конт.; Цепь
- (in symbol Соединитель FH12-10S-0.5SVA) Конт.; Цепь
- (in symbol Соединитель FH12-20S-0.5SVA) Конт.; Цепь
- (in symbol Соединитель IDC2-14MS) Цепь; Конт.; GND; VCC; TMS; TCLK; TDO; TDI
- (in symbol Фильтр EMI EClamp2394P) Z*
- (in symbol Чип предохранитель 0ZCM0002FF2G) I

### Library data of the parts
A1 = Модуль AM1/4S-0505SZ: 0.25 Watt | DC-DC Converter; Manufacturer: flex; Value: AM1/4S-0505SZ; ComponentLink1Description: datasheet; ComponentLink1URL: http://www.aimtec.com/site/Aimtec/files/Datasheet/HighResolution/AM1_4S-Z.pdf?ft4=0-357
C65-C69 C71 C75 C78 C81 C83 = Кер.ЧИП конд. 0402 0.1мкФ X7R 10%, 16В: as C11 on sheet MB_pwr_in_v2; PackageReference: 0402; Value: 0.1мк
C76 C82 = Кер.ЧИП конд. 0805 22мкФ X5R 10% 16В: as C1 on sheet MB_pwr_in_v2; Value: 22мк
C77 C79 C80 = Кер.ЧИП конд. 0402 1мкФ X5R 10%, 10В: as C?#4 on sheet MB_pwr_in_v2; PackageReference: 0402; Value: 1мк
C84 C85 = Кер.ЧИП конд. 0402 1000пФ NP0 5%, 50В: Кер. ЧИП-конденсатор; Power/Voltage: 50В; TKE: NPO; Tolerance: ±5%; PackageReference: 0402; Value: 1000
C86 = Кер.ЧИП конд. 0402 0.01мкФ X7R 10%, 50В: Кер. ЧИП-конденсатор; Power/Voltage: 50В; TKE: X7R; Tolerance: ±20%; Value: 0.01мк
D1 = Микросхема W25Q256JVEIQ: 3V 256M-BIT SERIAL FLASH MEMORY WITH DUAL/QUAD SPI /; Manufacturer: WINBOND; Value: W25Q256JVEIQ
D2 = Микросхема 25CSM04-I/MF: 4-Mbit SPI Serial EEPROM with 128-Bit Serial Number and Enhanced Write Protection; Manufacturer: MICROCHIP; ComponentLink1Description: Datasheet; ComponentLink1URL: https://ww1.microchip.com/downloads/en/DeviceDoc/25CSM04-4-Mbit-SPI-Serial-EEPROM-With-128-Bit-Serial-Number-and-Enhanced-Write-Protection-20005817C.pdf; Value: 25CSM04-I/MF
DA8 DA9 = ЧИП защитный диод PSD15C: HIGH POWERED TVS; Manufacturer: PROTEK; Power/Voltage: 15В; Value: PSD15C; ComponentLink1Description: datasheet; ComponentLink1URL: https://www.protekdevices.com/xyz/documents/datasheets/psd.pdf
DD1 = Микросхема XC7Z020-2CLG484I: as DD1 on sheet MB_pwr_in_v2; Value: XC7Z020-2CLG484I; ComponentLink1Description: datasheet; ComponentLink1URL: https://www.xilinx.com/support/documentation/data_sheets/ds925-zynq-ultrascale-plus.pdf
DD2 DD3 = Микросхема MAX13433EETD+: RS-422 Transceivers with Low-Voltage Logic Interface 16M; Manufacturer: Maxim; Value: MAX13433EETD+; ComponentLink1Description: datasheet; ComponentLink1URL: https://datasheets.maximintegrated.com/en/ds/MAX13430E-MAX13433E.pdf
DD4 = Микросхема ISO3080DWR: ISOLATED 5-V FULL DUPLEX RS-485 TRANSCEIVERS 200 kbps /; Manufacturer: TI; Value: ISO3080DWR
DD5 = Микросхема SN74LVC2G14DCKR: Dual Schmitt-Trigger Inverter; Manufacturer: TI; Value: SN74LVC2G14; ComponentLink1Description: datasheet; ComponentLink1URL: http://www.ti.com/lit/ds/symlink/sn74auc1g04.pdf
F1 F3 = Чип предохранитель 0ZCM0002FF2G: ЧИП-резистор; Manufacturer: Belfuse; PackageReference: 0603; Value: 20mA; ManufacturerPartNumber: 0ZCM0002FF2G
G1 = Генератор кварцевый ASFLMB-33.333MHZ: 33.333 MHz HCMOS/TTL Clock Oscillator; Manufacturer: Abracom; Value: 33.333 MHz
HL1 = Светодиод SMD FYLS-0603UGC (зеленый): ЧИП-светодиод; Manufacturer: FORYARD; PackageDocument: revH, May-2002; Published: 17-Sep-2003; DatasheetDocument: May-2002; PackageReference: 0603; Publisher: Altium Limited; ComponentLink1Description: Manufacturer Link; ComponentLink1URL: http://www.irf.com/; ComponentLink2Description: Datasheet; ComponentLink2URL: http://www.irf.com/product-info/datasheets/data/10MQ060N.pdf; Value: зеленый; ManufacturerPartNumber: FYLS-0603UGC
L9-L13 = ЧИП дроссель 0603 BLM18PG121SN1D: as L8 on sheet MB_pwr_in_v2; ManufacturerPartNumber: BLM18PG121SN1D; Value: BLM18PG121SN1D
L14 = ЧИП синфазный фильтр 0805 EXC34CE900U: Common Mode Noise Filters EXC34CG/CE type; Manufacturer: Panasonic; ManufacturerPartNumber: EXC34CE900U; Value: EXC34CE900U; ComponentLink1Description: datasheet; ComponentLink1URL: https://industrial.panasonic.com/cdbs/www-data/pdf/AWE0000/AWE0000C276.pdf
R11 R12 R19 R151 R156 R158 R159 = Чип резистор 0402 20 кОм, 5%: as R14 on sheet MB_pwr_in_v2; PackageReference: 0402; Value: 20к
R20 R21 R27-R30 R59 = Чип резистор 0402 10 кОм, 5%: as R8 on sheet MB_pwr_in_v2; PackageReference: 0402; Value: 10к
R22 R31 R32 = Чип резистор 0402 4,7 кОм, 5%: ЧИП-резистор; Tolerance: ±5%; TKE: 100 ppm/°С; PackageReference: 0402; Value: 4.7к
R23 R26 = Чип резистор 0402 510 Ом, 5%: ЧИП-резистор; Tolerance: ±5%; TKE: 100 ppm/°С; PackageReference: 0402; Value: 510
R24 R25 = Чип резистор 0402 4,7 кОм, 1%: ЧИП-резистор; Tolerance: ±1%; TKE: 100 ppm/°С; PackageReference: 0402; Value: 4.7к
R33-R36 R40 R41 = Чип резистор 0402 180 кОм, 5%: ЧИП-резистор; Tolerance: ±5%; TKE: 100 ppm/°С; PackageReference: 0402; Value: 180к
R37 R44 = Чип резистор 0402 2 кОм, 5%: ЧИП-резистор; Tolerance: ±5%; TKE: 100 ppm/°С; PackageReference: 0402; Value: 2к
R38 R39 = Чип резистор 0402 820 Ом, 5%: ЧИП-резистор; Tolerance: ±5%; TKE: 100 ppm/°С; PackageReference: 0402; Value: 820
R42 R43 = Чип резистор 0402 15 Ом, 5%: ЧИП-резистор; Tolerance: ±5%; TKE: 100 ppm/°С; PackageReference: 0402; Value: 15
R45 = Чип резистор 0402 3,3 кОм, 5%: ЧИП-резистор; Tolerance: ±5%; TKE: 100 ppm/°С; PackageReference: 0402; Value: 3.3к
R46 = Чип резистор 0402 120 Ом, 5%: ЧИП-резистор; Tolerance: ±5%; TKE: 100 ppm/°С; PackageReference: 0402; Value: 120
VD1 VD2 = ЧИП диод BAS16: High-speed switching diodes; Manufacturer: Nexperia; Power/Voltage: 100В; ManufacturerPartNumber: BAS16; Value: BAS16; ComponentLink1Description: datasheet; ComponentLink1URL: https://assets.nexperia.com/documents/data-sheet/BAS16_SER.pdf
VU1 VU2 = Оптопара транзисторная PC3H7J00000F: Mini-falt Package, General Purpose Half Pitch Photocouper; PackageReference: SOP-4; ComponentLink1Description: Manufacturer Link; ComponentLink1URL: http://www.vishay.com/optocouplers/list/product-83640/; ComponentLink2Description: Datasheet; ComponentLink2URL: http://www.vishay.com/docs/83640/83640.pdf; Value: PC3H7J00000F
X1 X2 = Соединение под пайку: Соединитель; Value: Конструктивный элемент
XP2 = Соединитель IDC2-14MS: JTAG Xilinx IDC2-14MS; Manufacturer: Molex; Value: IDC2-14MS
XP3 = Соединитель FH12-20S-0.5SVA: FPC Connectors, Flex-to-Board, 20 Position, .5mm [.02in]; Value: FH12-20S-0.5SVA
XP4 = Соединитель FH12-10S-0.5SVA: 0.5mm  Pitch FPC/FFC Connector FH12 Series; Manufacturer: Hirose; Value: FH12-10S-0.5SVA
XP7 = Соединитель PLS-3 (DS1021-1x3): Вилка штыревая 2.54мм 1x3 прямая тип1; Value: PLS-3
XS3 = Соединитель DHR-15FB (DS1038-15F): Гнездо 15 pin высокой плотности на плату; Manufacturer: Connfly; Value: DS1038-15F
Z1-Z3 = Фильтр EMI EClamp2394P: ESD/EMI Protection  for Color LCD Interfaces; Manufacturer: SEMTECH; PackageReference: SLP2116P8; Value: EClamp2394P

## Sheet MB_ddr.SchDoc: Материнская плата
size 420 x 297 mm; DrawnBy: В.Титов; DocumentNumber: ХХХХ.468179.001 Э3; SheetNumber: 3; SheetTotal: 7; DocumentType: Схема электрическая принципиальная; Title2: Питание процессора
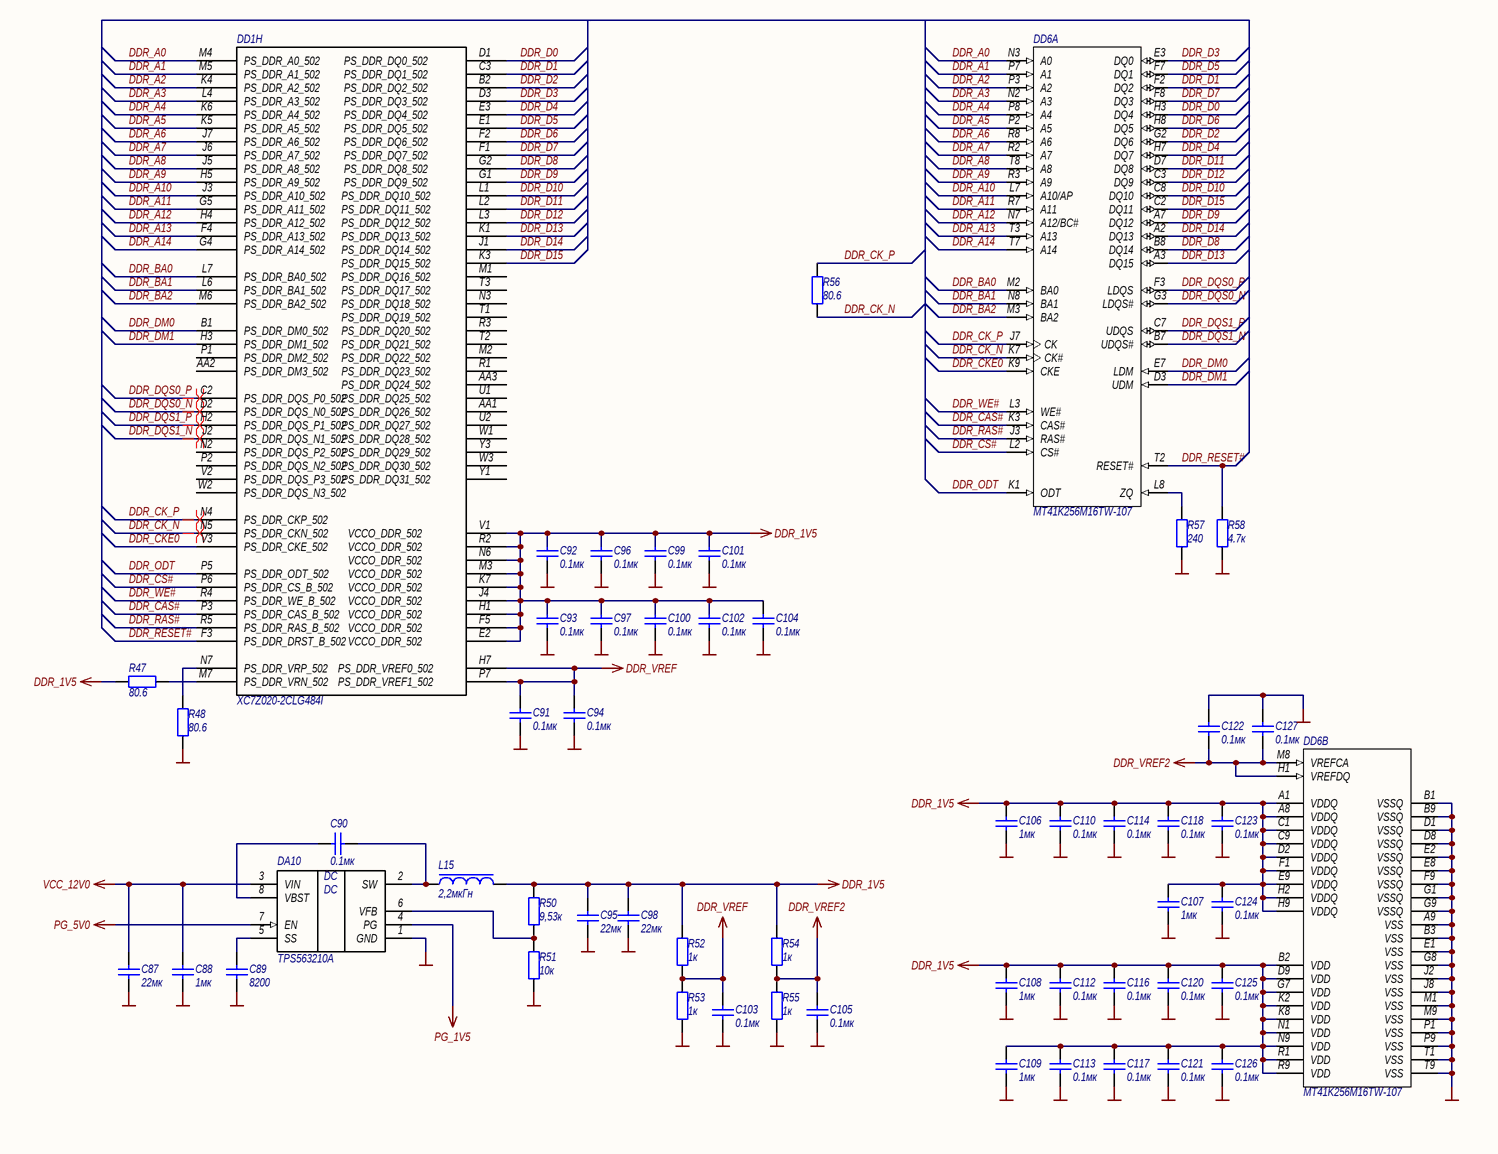
[diagram p2: MB_ddr.SchDoc]

### Parts
C87  22мк  [CAPC2012X12L]
C88  1мк  [CAPC1005X06N]
C89  8200  [CAPC1005X06N]
C90  0.1мк  [CAPC1005X06N]
C91  0.1мк  [CAPC1005X06N]
C92  0.1мк  [CAPC1005X06N]
C93  0.1мк  [CAPC1005X06N]
C94  0.1мк  [CAPC1005X06N]
C95  22мк  [CAPC2012X12L]
C96  0.1мк  [CAPC1005X06N]
C97  0.1мк  [CAPC1005X06N]
C98  22мк  [CAPC2012X12L]
C99  0.1мк  [CAPC1005X06N]
C100  0.1мк  [CAPC1005X06N]
C101  0.1мк  [CAPC1005X06N]
C102  0.1мк  [CAPC1005X06N]
C103  0.1мк  [CAPC1005X06N]
C104  0.1мк  [CAPC1005X06N]
C105  0.1мк  [CAPC1005X06N]
C106  1мк  [CAPC1005X06N]
C107  1мк  [CAPC1005X06N]
C108  1мк  [CAPC1005X06N]
C109  1мк  [CAPC1005X06N]
C110  0.1мк  [CAPC1005X06N]
C112  0.1мк  [CAPC1005X06N]
C113  0.1мк  [CAPC1005X06N]
C114  0.1мк  [CAPC1005X06N]
C116  0.1мк  [CAPC1005X06N]
C117  0.1мк  [CAPC1005X06N]
C118  0.1мк  [CAPC1005X06N]
C120  0.1мк  [CAPC1005X06N]
C121  0.1мк  [CAPC1005X06N]
C122  0.1мк  [CAPC1005X06N]
C123  0.1мк  [CAPC1005X06N]
C124  0.1мк  [CAPC1005X06N]
C125  0.1мк  [CAPC1005X06N]
C126  0.1мк  [CAPC1005X06N]
C127  0.1мк  [CAPC1005X06N]
DA10  TPS563210A  [TSOP65P280X110-8N]
DD1  XC7Z020-2CLG484I  [BGA484C80P22X22_1900X1900X160]  (part H of 9)
DD6  MT41K256M16TW-107  [BGA96C80P9X16_800X1400X110]  (parts A,B of 2)
L15  2,2мкГн  [CSAB0420]
R47  80.6  [RESC1005X06N]
R48  80.6  [RESC1005X06N]
R50  9,53к  [RESC1005X06N]
R51  10к  [RESC1005X06N]
R52  1к  [RESC1005X06N]
R53  1к  [RESC1005X06N]
R54  1к  [RESC1005X06N]
R55  1к  [RESC1005X06N]
R56  80.6  [RESC1005X06N]
R57  240  [RESC1005X06N]
R58  4.7к  [RESC1005X06N]

### Nets
DDR_1V5: C92.2 C93.2 C95.2 C96.2 C97.2 C98.2 C99.2 C100.2 C101.2 C102.2 C104.2 C106.2 C107.2 C108.2 C109.2 C110.2 C112.2 C113.2 C114.2 C116.2 C117.2 C118.2 C120.2 C121.2 C123.2 C124.2 C125.2 C126.2 DD1.E2(VCCO_DDR_502) DD1.F5(VCCO_DDR_502) DD1.H1(VCCO_DDR_502) DD1.J4(VCCO_DDR_502) DD1.K7(VCCO_DDR_502) DD1.M3(VCCO_DDR_502) DD1.N6(VCCO_DDR_502) DD1.R2(VCCO_DDR_502) DD1.V1(VCCO_DDR_502) DD6.A1(VDDQ) DD6.A8(VDDQ) DD6.B2(VDD) DD6.C1(VDDQ) DD6.C9(VDDQ) DD6.D2(VDDQ) DD6.D9(VDD) DD6.E9(VDDQ) DD6.F1(VDDQ) DD6.G7(VDD) DD6.H2(VDDQ) DD6.H9(VDDQ) DD6.K2(VDD) DD6.K8(VDD) DD6.N1(VDD) DD6.N9(VDD) DD6.R1(VDD) DD6.R9(VDD) L15.2 R47.2 R50.2 R52.1 R54.1
DDR_VREF: C91.2 C94.2 C103.2 DD1.H7(PS_DDR_VREF0_502) DD1.P7(PS_DDR_VREF1_502) R52.2 R53.1
DDR_VREF2: C105.2 C122.1 C127.1 DD6.H1(VREFDQ) DD6.M8(VREFCA) R54.2 R55.1
GND: C87.1 C88.1 C89.1 C91.1 C92.1 C93.1 C94.1 C95.1 C96.1 C97.1 C98.1 C99.1 C100.1 C101.1 C102.1 C103.1 C104.1 C105.1 C106.1 C107.1 C108.1 C109.1 C110.1 C112.1 C113.1 C114.1 C116.1 C117.1 C118.1 C120.1 C121.1 C122.2 C123.1 C124.1 C125.1 C126.1 C127.2 DA10.1(GND) DD6.A9(VSS) DD6.B1(VSSQ) DD6.B3(VSS) DD6.B9(VSSQ) DD6.D1(VSSQ) DD6.D8(VSSQ) DD6.E1(VSS) DD6.E2(VSSQ) DD6.E8(VSSQ) DD6.F9(VSSQ) DD6.G1(VSSQ) DD6.G8(VSS) DD6.G9(VSSQ) DD6.J2(VSS) DD6.J8(VSS) DD6.M1(VSS) DD6.M9(VSS) DD6.P1(VSS) DD6.P9(VSS) DD6.T1(VSS) DD6.T9(VSS) R48.2 R51.2 R53.2 R55.2 R57.2 R58.2
PG_1V5: DA10.4(PG)
PG_5V0: DA10.7(EN)
VCC_12V0: C87.2 C88.2 DA10.3(VIN)
DDR_A0: DD1.M4(PS_DDR_A0_502) DD6.N3(A0)
DDR_A1: DD1.M5(PS_DDR_A1_502) DD6.P7(A1)
DDR_A2: DD1.K4(PS_DDR_A2_502) DD6.P3(A2)
DDR_A3: DD1.L4(PS_DDR_A3_502) DD6.N2(A3)
DDR_A4: DD1.K6(PS_DDR_A4_502) DD6.P8(A4)
DDR_A5: DD1.K5(PS_DDR_A5_502) DD6.P2(A5)
DDR_A6: DD1.J7(PS_DDR_A6_502) DD6.R8(A6)
DDR_A7: DD1.J6(PS_DDR_A7_502) DD6.R2(A7)
DDR_A8: DD1.J5(PS_DDR_A8_502) DD6.T8(A8)
DDR_A9: DD1.H5(PS_DDR_A9_502) DD6.R3(A9)
DDR_A10: DD1.J3(PS_DDR_A10_502) DD6.L7(A10/AP)
DDR_A11: DD1.G5(PS_DDR_A11_502) DD6.R7(A11)
DDR_A12: DD1.H4(PS_DDR_A12_502) DD6.N7(A12/BC#)
DDR_A13: DD1.F4(PS_DDR_A13_502) DD6.T3(A13)
DDR_A14: DD1.G4(PS_DDR_A14_502) DD6.T7(A14)
DDR_BA0: DD1.L7(PS_DDR_BA0_502) DD6.M2(BA0)
DDR_BA1: DD1.L6(PS_DDR_BA1_502) DD6.N8(BA1)
DDR_BA2: DD1.M6(PS_DDR_BA2_502) DD6.M3(BA2)
DDR_CAS#: DD1.P3(PS_DDR_CAS_B_502) DD6.K3(CAS#)
DDR_CK_N: DD1.N5(PS_DDR_CKN_502) DD6.K7(CK#) R56.2
DDR_CK_P: DD1.N4(PS_DDR_CKP_502) DD6.J7(CK) R56.1
DDR_CKE0: DD1.V3(PS_DDR_CKE_502) DD6.K9(CKE)
DDR_CS#: DD1.P6(PS_DDR_CS_B_502) DD6.L2(CS#)
DDR_D0: DD1.D1(PS_DDR_DQ0_502) DD6.H3(DQ4)
DDR_D1: DD1.C3(PS_DDR_DQ1_502) DD6.F2(DQ2)
DDR_D2: DD1.B2(PS_DDR_DQ2_502) DD6.G2(DQ6)
DDR_D3: DD1.D3(PS_DDR_DQ3_502) DD6.E3(DQ0)
DDR_D4: DD1.E3(PS_DDR_DQ4_502) DD6.H7(DQ7)
DDR_D5: DD1.E1(PS_DDR_DQ5_502) DD6.F7(DQ1)
DDR_D6: DD1.F2(PS_DDR_DQ6_502) DD6.H8(DQ5)
DDR_D7: DD1.F1(PS_DDR_DQ7_502) DD6.F8(DQ3)
DDR_D8: DD1.G2(PS_DDR_DQ8_502) DD6.B8(DQ14)
DDR_D9: DD1.G1(PS_DDR_DQ9_502) DD6.A7(DQ12)
DDR_D10: DD1.L1(PS_DDR_DQ10_502) DD6.C8(DQ10)
DDR_D11: DD1.L2(PS_DDR_DQ11_502) DD6.D7(DQ8)
DDR_D12: DD1.L3(PS_DDR_DQ12_502) DD6.C3(DQ9)
DDR_D13: DD1.K1(PS_DDR_DQ13_502) DD6.A3(DQ15)
DDR_D14: DD1.J1(PS_DDR_DQ14_502) DD6.A2(DQ13)
DDR_D15: DD1.K3(PS_DDR_DQ15_502) DD6.C2(DQ11)
DDR_DM0: DD1.B1(PS_DDR_DM0_502) DD6.E7(LDM)
DDR_DM~{1}: DD1.H3(PS_DDR_DM1_502) DD6.D3(UDM)
DDR_DQS0_N: DD1.D2(PS_DDR_DQS_N0_502) DD6.G3(LDQS#)
DDR_DQS0_P: DD1.C2(PS_DDR_DQS_P0_502) DD6.F3(LDQS)
DDR_DQS1_N: DD1.J2(PS_DDR_DQS_N1_502) DD6.B7(UDQS#)
DDR_DQS1_P: DD1.H2(PS_DDR_DQS_P1_502) DD6.C7(UDQS)
DDR_ODT: DD1.P5(PS_DDR_ODT_502) DD6.K1(ODT)
DDR_RAS#: DD1.R5(PS_DDR_RAS_B_502) DD6.J3(RAS#)
DDR_RESET#: DD1.F3(PS_DDR_DRST_B_502) DD6.T2(RESET#) R58.1
DDR_WE#: DD1.R4(PS_DDR_WE_B_502) DD6.L3(WE#)
NetC89_2: C89.2 DA10.5(SS)
NetC90_1: C90.1 DA10.2(SW) L15.1
NetC90_2: C90.2 DA10.8(VBST)
NetDA10_6: DA10.6(VFB) R50.1 R51.1
NetDD1_M7    : DD1.M7(PS_DDR_VRN_502) R47.1
NetDD1_N7    : DD1.N7(PS_DDR_VRP_502) R48.1
NetDD6_L8: DD6.L8(ZQ) R57.1

Not connected (* = marked no-connect by the designer): DD1 AA1   (PS_DDR_DQ26_502__________) AA2   (PS_DDR_DM3_502___________) AA3   (PS_DDR_DQ24_502__________) M1    (PS_DDR_DQ16_502__________) M2    (PS_DDR_DQ22_502__________) N2    (PS_DDR_DQS_P2_502________) N3    (PS_DDR_DQ18_502__________) P1    (PS_DDR_DM2_502___________) P2    (PS_DDR_DQS_N2_502________) R1    (PS_DDR_DQ23_502__________) R3    (PS_DDR_DQ20_502__________) T1    (PS_DDR_DQ19_502__________) T2    (PS_DDR_DQ21_502__________) T3    (PS_DDR_DQ17_502__________) U1    (PS_DDR_DQ25_502__________) U2    (PS_DDR_DQ27_502__________) V2    (PS_DDR_DQS_P3_502________) W1    (PS_DDR_DQ28_502__________) W2    (PS_DDR_DQS_N3_502________) W3    (PS_DDR_DQ30_502__________) Y1    (PS_DDR_DQ31_502__________) Y3    (PS_DDR_DQ29_502__________)

### Layout directives
differential pair: DDR_CK_N, DDR_CK_P, DDR_DQS0_N, DDR_DQS0_P, DDR_DQS1_N, DDR_DQS1_P

### Notes on the sheet
- Перв. примен.
- Справ. №
- Подп. и дата
- Инв. № дубл.
- Взаим. инв. №
- Инв. № подл.
- Лист
- Изм.
- № докум.
- Подп.
- Дата
- Копировал
- Формат А3
- (in symbol Микросхема TPS563210A) DC

### Library data of the parts
C87 C95 C98 = Кер.ЧИП конд. 0805 22мкФ X5R 10% 16В: as C1 on sheet MB_pwr_in_v2; Value: 22мк
C88 C106-C109 = Кер.ЧИП конд. 0402 1мкФ X5R 10%, 10В: as C?#4 on sheet MB_pwr_in_v2; PackageReference: 0402; Value: 1мк
C89 = Кер.ЧИП конд. 0402 8200пФ X7R 10%, 50В: as C18 on sheet MB_pwr_in_v2; Value: 8200
C90-C94 C96 C97 C99-C105 C110 C112-C114 C116-C118 C120-C127 = Кер.ЧИП конд. 0402 0.1мкФ X7R 10%, 16В: as C11 on sheet MB_pwr_in_v2; PackageReference: 0402; Value: 0.1мк
DA10 = Микросхема TPS563210A: as DA2 on sheet MB_pwr_in_v2; Value: TPS563210A
DD1 = Микросхема XC7Z020-2CLG484I: as DD1 on sheet MB_pwr_in_v2; Value: XC7Z020-2CLG484I; ComponentLink1Description: datasheet; ComponentLink1URL: https://www.xilinx.com/support/documentation/data_sheets/ds925-zynq-ultrascale-plus.pdf
DD6 = Микросхема MT41K256M16TW-107: 4Gb, x16, 1.35V DDR3L; Manufacturer: Micron; PartNumber: MT41K128M16JT-125; CL: CL = 13; Clock Rate: 667 MHz; Cycle Time: 1.07ns; Data Rate: DDR3-1866; Density: 2Gb; Op. Temp.: 0C to +95C; DatasheetVersion: Rev.F; PackageVersion: Rev.G; PackageReference: MICT-JT-96; PackageDescription: 96-Ball Fine-Pitch Ball Grid Array, 14 x 8 mm, Pitch 0.8 mm; Depth: 256M16; Package: FBGA; Pin Count: 96-ball; RoHS: Yes; Voltage: 1.35V; Width: x16; Mounting Technology: Surface Mount; ComponentLink1Description: Manufacturer URL; ComponentLink1URL: http://www.micron.com/; ComponentLink2Description: Datasheet; ComponentLink2URL: http://www.micron.com/~/media/Documents/Products/Data%20Sheet/DRAM/2Gb_DDR3_SDRAM.pdf; ComponentLink3Description: Package Specification; ComponentLink3URL: http://www.micron.com/~/media/Documents/Products/Data%20Sheet/DRAM/2Gb_DDR3_SDRAM.pdf; Value: MT41K256M16TW-107
L15 = ЧИП индуктивность CSAB0420-2R2M: as L1 on sheet MB_pwr_in_v2; Value: 2,2мкГн
R47 R48 R56 = Чип резистор 0402 80,6 Ом, 1%_1: ЧИП-резистор; Tolerance: ±1%; TKE: 100 ppm/°С; PackageReference: 0402; Value: 80.6
R50 = Чип резистор 0402 9,53 кОм, 1%: ЧИП-резистор; Tolerance: ±1%; TKE: 100 ppm/°С; PackageReference: 0402; Value: 9,53к
R51 = Чип резистор 0402 10 кОм, 1%: as R2 on sheet MB_pwr_in_v2; PackageReference: 0402; Value: 10к
R52-R55 = Чип резистор 0402 1 кОм, 5%: ЧИП-резистор; Tolerance: ±5%; TKE: 100 ppm/°С; PackageReference: 0402; Value: 1к
R57 = Чип резистор 0402 240 Ом, 5%: ЧИП-резистор; Tolerance: ±5%; TKE: 100 ppm/°С; PackageReference: 0402; Value: 240
R58 = Чип резистор 0402 4,7 кОм, 5%: as R22 on sheet MB_ps_io; PackageReference: 0402; Value: 4.7к